# EAGLE design SIM_dummy (EAGLE 6.6.0)
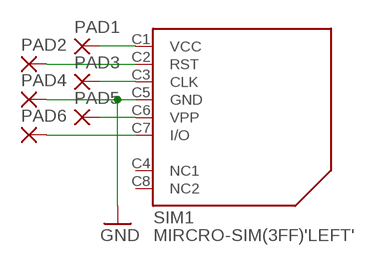
[diagram p0: schematic, sheet 1]

## Parts
PAD1  SMD2  [SMD1,27-2,54]
PAD2  SMD2  [SMD1,27-2,54]
PAD3  SMD2  [SMD1,27-2,54]
PAD4  SMD2  [SMD1,27-2,54]
PAD5  SMD2  [SMD1,27-2,54]
PAD6  SMD2  [SMD1,27-2,54]
SIM1  MIRCRO-SIM(3FF)'LEFT'  [MICRO-SIM_LEFT]

## Nets
GND: PAD4.1(P) SIM1.C5(GND)
N$1: PAD6.1(P) SIM1.C7(I/O)
N$2: PAD2.1(P) SIM1.C2(RST)
N$3: PAD3.1(P) SIM1.C3(CLK)
N$4: PAD1.1(P) SIM1.C1(VCC)
N$5: PAD5.1(P) SIM1.C6(VPP)
Unconnected: SIM1.C4(NC1) SIM1.C8(NC2)

## Library data of the parts
PAD1-PAD6 = wirepad:SMD2: SMD PAD
SIM1 = sim-card:MIRCRO-SIM(3FF)

## Board
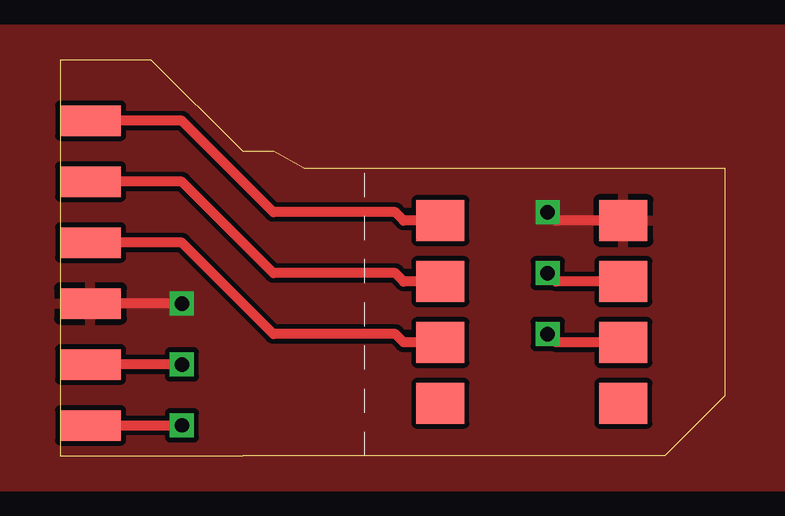
[diagram p1: board, top side]
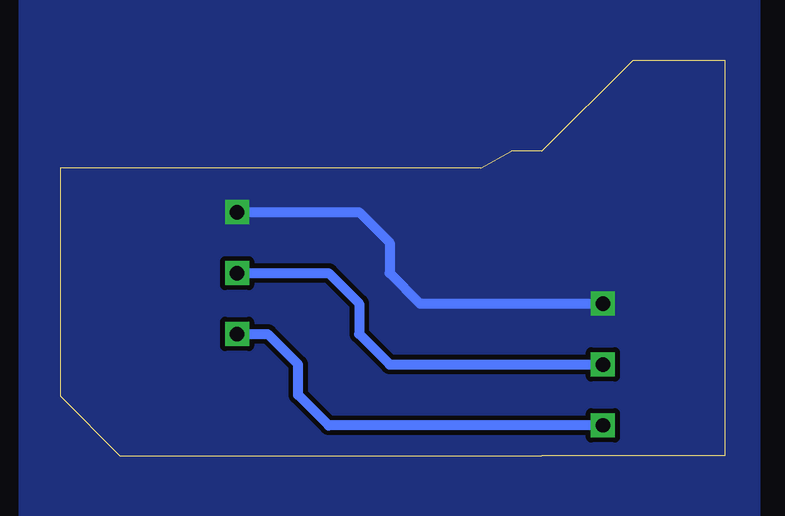
[diagram p2: board, bottom side, seen from below]

Size 27.7 x 16.51 mm. Coordinates in mm from the lower left corner, seen from the top.
Outline: 7.62,12.7 3.81,16.51 0,16.51 0,0 7.62,0
Copper layers (1*16): Top 0.035mm / dielectric 1.5mm / Bottom 0.035mm
Design rules "default *": minimum track width 10mil, minimum drill 24mil, track to track 8mil, track to pad 8mil, pad to pad 8mil, via to via 8mil, smd to smd 8mil, copper to edge 0mil, drill to drill 8mil, minimum pad ring 10mil, minimum via ring 8mil, stop-mask expansion 4mil, vias tented up to drill 0mil, thermal gap 10mil

### Footprints (pad centres in the part's own frame; a part is rotated, then mirrored left to right if it is on the bottom)
SMD1,27-2,54 = smd 1.27 x 2.54: 1 0,0
MICRO-SIM_LEFT = smd 2 x 1.7: C1 3.15,9.81; C2 3.15,7.27; C3 3.15,4.73; C4 3.15,2.19; C5 10.77,9.81; C6 10.77,7.27; C7 10.77,4.73; C8 10.77,2.19

### Placement (x,y rotation side)
PAD1  1.27,13.97 270 top
PAD2  1.27,11.43 270 top
PAD3  1.27,8.89 270 top
PAD4  1.27,6.35 270 top
PAD5  1.27,3.81 270 top
PAD6  1.27,1.27 270 top
SIM1  12.7,0 0 top

### Tracks (layer width: path | path; a pad name or v marks a point on that pad's centre or on a via)
GND  (via drill 0.6)
  Top 0.406: SIM1.C5 20.67,9.81 v20.32,10.16 | v5.08,6.35 PAD4.1
  Bottom 0.406: v20.32,10.16 15.24,10.16 13.97,8.89 13.97,7.62 12.7,6.35 v5.08,6.35
  pour Bottom: -1.27,-2.54 29.21,-2.54 29.21,19.05 -1.27,19.05
  pour Top: -2.54,-1.27 30.48,-1.27 30.48,17.78 -2.54,17.78
N$1  (via drill 0.6)
  Top 0.406: SIM1.C7 20.67,4.73 v20.32,5.08 | PAD6.1 v5.08,1.27
  Bottom 0.406: v20.32,5.08 19.05,5.08 17.78,3.81 17.78,2.54 16.51,1.27 v5.08,1.27
N$2
  Top 0.406: SIM1.C2 14.32,7.27 13.97,7.62 8.89,7.62 5.08,11.43 PAD2.1
N$3
  Top 0.406: SIM1.C3 14.32,4.73 13.97,5.08 8.89,5.08 5.08,8.89 PAD3.1
N$4
  Top 0.406: SIM1.C1 14.32,9.81 13.97,10.16 8.89,10.16 5.08,13.97 PAD1.1
N$5  (via drill 0.6)
  Top 0.406: SIM1.C6 20.67,7.27 v20.32,7.62 | v5.08,3.81 PAD5.1
  Bottom 0.406: v20.32,7.62 16.51,7.62 15.24,6.35 15.24,5.08 13.97,3.81 v5.08,3.81